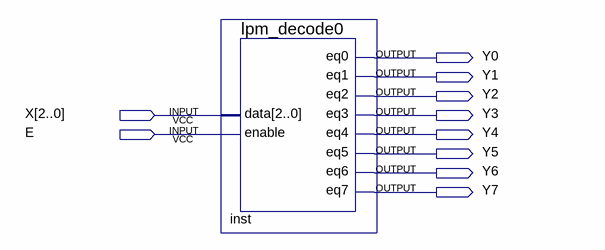
[diagram p0: schematic sheet]
// Quartus schematic pract5.bdf as structural Verilog: 1 symbols, 10 pins
module pract5 (
  input  [2:0] X,
  input  E,
  output Y0,
  output Y1,
  output Y2,
  output Y3,
  output Y4,
  output Y5,
  output Y6,
  output Y7
);

  lpm_decode0 inst (
    .data(X), .enable(E), .eq0(Y0), .eq1(Y1), .eq2(Y2), .eq3(Y3), .eq4(Y4), .eq5(Y5), .eq6(Y6), .eq7(Y7));
endmodule
